# Altium schematic sheet DS157-1.0-A心率传感器.SchDoc
size A4; SheetNumber: 1; SheetTotal: 1
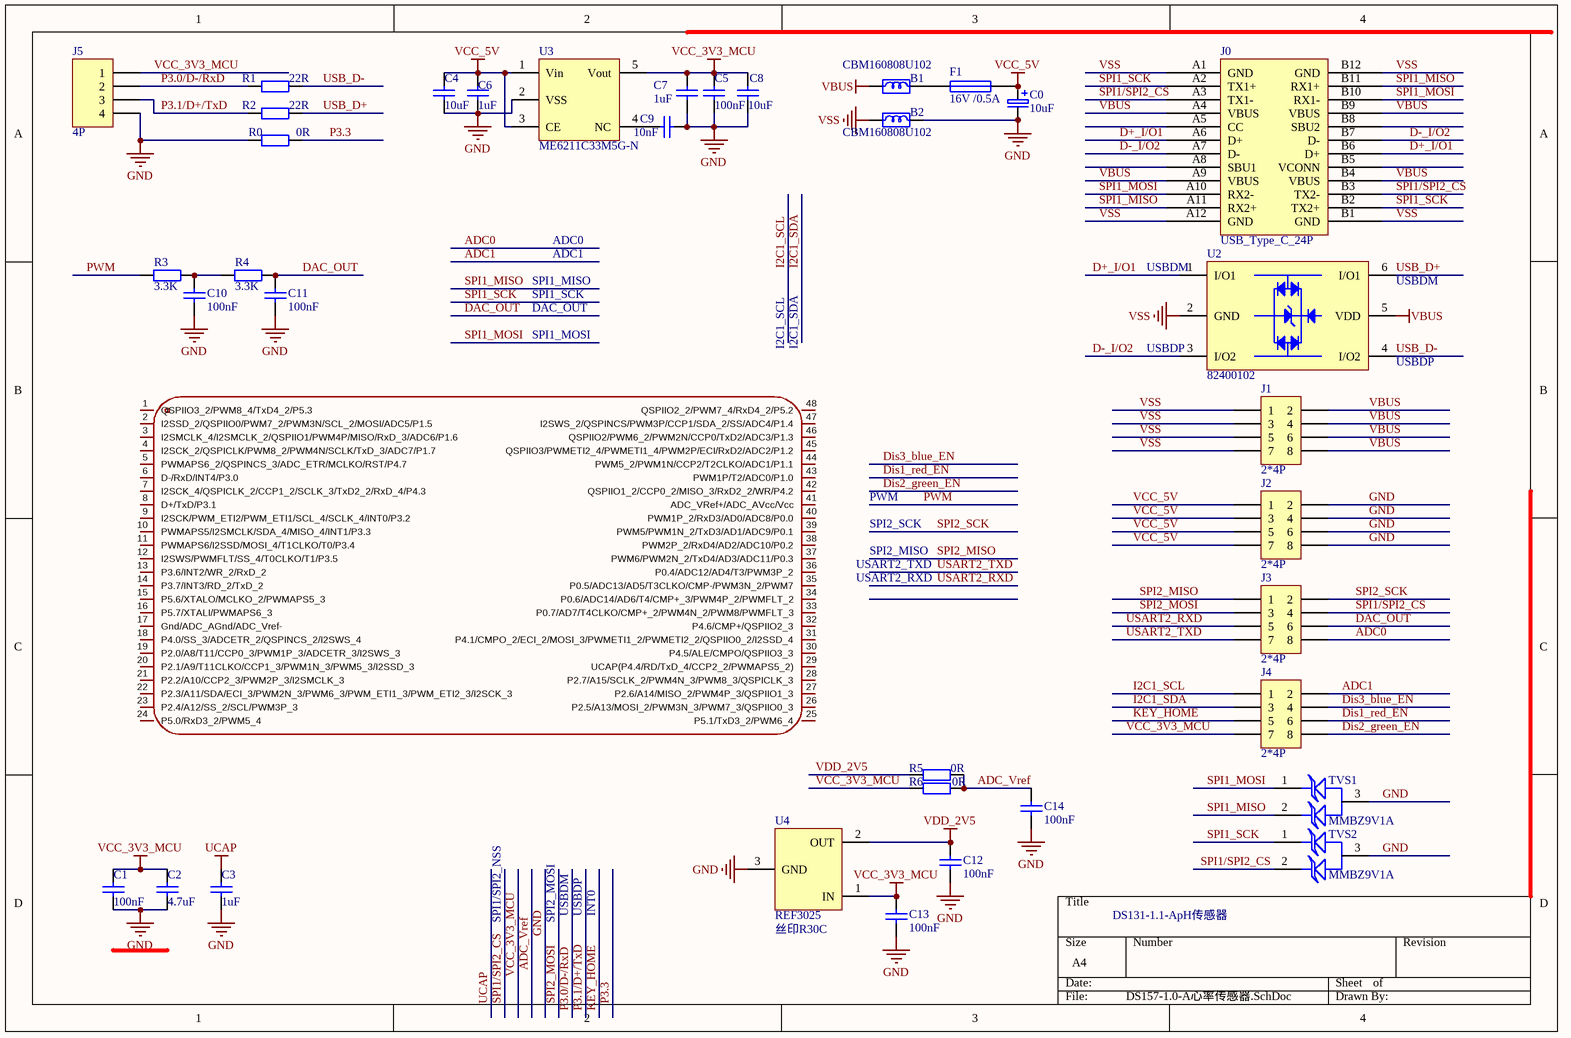
[diagram p0: DS157-1.0-A心率传感器.SchDoc]

## Parts
B1  CBM160808U102  [0603Bead]
B2  CBM160808U102  [0603Bead]
C0  value 10uF  [AVX_3216-18(1206)_SMD]  (hidden comment: AVX_10uF/16V ±10％(C106))
C1  value 100nF  [0603CAP]  (hidden comment: SMDCAP00013)
C2  value 4.7uF  [0603CAP]  (hidden comment: SMDCAP00012)
C3  value 1uF  [0603CAP]  (hidden comment: SMDCAP00015)
C4  value 10uF  [1206CAP]  (hidden comment: MLCC 10uF 50V ±20％ 1206)
C5  value 100nF  [0603CAP]  (hidden comment: SMDCAP00013)
C6  value 1uF  [0603CAP]  (hidden comment: SMDCAP00015)
C7  value 1uF  [0603CAP]  (hidden comment: SMDCAP00015)
C8  value 10uF  [1206CAP]  (hidden comment: MLCC 10uF 50V ±20％ 1206)
C9  value 10nF  [0603CAP]  (hidden comment: SMDCAP00010)
C10  value 100nF  [0603CAP]  (hidden comment: SMDCAP00013)
C11  value 100nF  [0603CAP]  (hidden comment: SMDCAP00013)
C12  value 100nF  [0603CAP]  (hidden comment: SMDCAP00013)
C13  value 100nF  [0603CAP]  (hidden comment: SMDCAP00013)
C14  value 100nF  [0603CAP]  (hidden comment: SMDCAP00013)
F1  value 16V /0.5A  [1206FUSE]  (hidden comment: SMD1206-050C-16V)
J0  USB_Type_C_24P  [USB_TYPE_C_24P_Receptacle]
J1  value 2*4P  [X1321FVS-2x04-C43D48]  (hidden comment: X1321FVS-2x04-C43D48)
J2  value 2*4P  [X1321FVS-2x04-C43D48]  (hidden comment: X1321FVS-2x04-C43D48)
J3  value 2*4P  [X1321FVS-2x04-C43D48]  (hidden comment: X1321FVS-2x04-C43D48)
J4  value 2*4P  [X1321FVS-2x04-C43D48]  (hidden comment: X1321FVS-2x04-C43D48)
J5  value 4P  [H4]  (hidden comment: DIP4单排直针  间距2mm 针长11mm 铜)
R0  value 0R  [0603RES]  (hidden comment: Chip 0R 1/16W ±1％ 0603)
R1  value 22R  [0603RES]  (hidden comment: Chip 22R 1/16W ±1％ 0603)
R2  value 22R  [0603RES]  (hidden comment: Chip 22R 1/16W ±1％ 0603)
R3  value 3.3K  [0603RES]  (hidden comment: SMDRES00090)
R4  value 3.3K  [0603RES]  (hidden comment: SMDRES00090)
R5  value 0R  [0603RES]  (hidden comment: Chip 0R 1/16W ±1％ 0603)
R6  value 0R  [0603RES]  (hidden comment: Chip 0R 1/16W ±1％ 0603)
TVS1  MMBZ9V1A  [SOT23]
TVS2  MMBZ9V1A  [SOT23]
U2  82400102  [SOT23-6]
U3  ME6211C33M5G-N  [SOT23-5]
U4  REF3025  value 丝印R30C  [SOT23]
U?  stc8051u-34k64-qfp48  [LQFP-48]  (value not drawn)

## Nets
GND: B2.2 C0.2 C1.1 C2.1 C3.1 C4.1 C5.1 C6.1 C7.1 C8.1 C9.2 C10.1 C11.1 C12.1 C13.1 C14.1 J2.2 J2.4 J2.6 J2.8 J5.4 R0.1 TVS1.3 TVS2.3 U3.2(VSS) U4.3(GND)
UCAP: C3.2
VBUS: B1.1 J0.A4(VBUS) J0.A9(VBUS) J0.B4(VBUS) J0.B9(VBUS) J1.2 J1.4 J1.6 J1.8 U2.5(VDD)
VCC_3V3_MCU: C1.2 C2.2 C5.2 C7.2 C8.2 C13.2 J4.7 J5.1 R6.1 U3.5(Vout) U4.1(IN)
VCC_5V: C0.1 C4.2 C6.2 F1.2 J2.1 J2.3 J2.5 J2.7 U3.1(Vin) U3.3(CE)
VDD_2V5: C12.2 R5.1 U4.2(OUT)
VSS: B2.1 J0.A1(GND) J0.A12(GND) J0.B1(GND) J0.B12(GND) J1.1 J1.3 J1.5 J1.7 U2.2(GND)
ADC0: J3.8
ADC1: J4.2
ADC_Vref: C14.2 R5.2 R6.2
D+_I/O1: J0.A6(D+) J0.B6(D+) U2.1(I/O1)
D-_I/O2: J0.A7(D-) J0.B7(D-) U2.3(I/O2)
DAC_OUT: C11.2 J3.6 R4.2
Dis1_red_EN: J4.6
Dis2_green_EN: J4.8
Dis3_blue_EN: J4.4
I2C1_SCL: J4.1
I2C1_SDA: J4.3
KEY_HOME: J4.5
P3.0/D-/RxD: J5.2 R1.1
P3.1/D+/TxD: J5.3 R2.1
P3.3: R0.2
PWM: R3.1
SPI1/SPI2_CS: J0.A3(TX1-) J0.B3(TX2-) J3.4 TVS2.2
SPI1_MISO: J0.A11(RX2+) J0.B11(RX1+) TVS1.2
SPI1_MOSI: J0.A10(RX2-) J0.B10(RX1-) TVS1.1
SPI1_SCK: J0.A2(TX1+) J0.B2(TX2+) TVS2.1
SPI2_MISO: J3.1
SPI2_MOSI: J3.3
SPI2_SCK: J3.2
USART2_RXD: J3.5
USART2_TXD: J3.7
USB_D+: R2.2 U2.6(I/O1)
USB_D-: R1.2 U2.4(I/O2)
NetB1_2: B1.2 F1.1
NetC9_1: C9.1 U3.4(NC)
NetC10_2: C10.2 R3.2 R4.1

Not connected (* = marked no-connect by the designer): J0 A5(CC) A8(SBU1) B5(VCONN) B8(SBU2); U? 1(QSPIIO3_2/PWM8_4/TxD4_2/P5.3) 2(I2SSD_2/QSPIIO0/PWM7_2/PWM3N/SCL_2/MOSI/ADC5/P1.5) 3(I2SMCLK_4/I2SMCLK_2/QSPIIO1/PWM4P/MISO/RxD_3/ADC6/P1.6) 4(I2SCK_2/QSPICLK/PWM8_2/PWM4N/SCLK/TxD_3/ADC7/P1.7) 5(PWMAPS6_2/QSPINCS_3/ADC_ETR/MCLKO/RST/P4.7) 6(D-/RxD/INT4/P3.0) 7(I2SCK_4/QSPICLK_2/CCP1_2/SCLK_3/TxD2_2/RxD_4/P4.3) 8(D+/TxD/P3.1) 9(I2SCK/PWM_ETI2/PWM_ETI1/SCL_4/SCLK_4/INT0/P3.2) 10(PWMAPS5/I2SMCLK/SDA_4/MISO_4/INT1/P3.3) 11(PWMAPS6/I2SSD/MOSI_4/T1CLKO/T0/P3.4) 12(I2SWS/PWMFLT/SS_4/T0CLKO/T1/P3.5) 13(P3.6/INT2/WR_2/RxD_2) 14(P3.7/INT3/RD_2/TxD_2) 15(P5.6/XTALO/MCLKO_2/PWMAPS5_3) 16(P5.7/XTALI/PWMAPS6_3) 17(Gnd/ADC_AGnd/ADC_Vref-) 18(P4.0/SS_3/ADCETR_2/QSPINCS_2/I2SWS_4) 19(P2.0/A8/T11/CCP0_3/PWM1P_3/ADCETR_3/I2SWS_3) 20(P2.1/A9/T11CLKO/CCP1_3/PWM1N_3/PWM5_3/I2SSD_3) 21(P2.2/A10/CCP2_3/PWM2P_3/I2SMCLK_3) 22(P2.3/A11/SDA/ECI_3/PWM2N_3/PWM6_3/PWM_ETI1_3/PWM_ETI2_3/I2SCK_3) 23(P2.4/A12/SS_2/SCL/PWM3P_3) 24(P5.0/RxD3_2/PWM5_4) 25(P5.1/TxD3_2/PWM6_4) 26(P2.5/A13/MOSI_2/PWM3N_3/PWM7_3/QSPIIO0_3) 27(P2.6/A14/MISO_2/PWM4P_3/QSPIIO1_3) 28(P2.7/A15/SCLK_2/PWM4N_3/PWM8_3/QSPICLK_3) 29(UCAP(P4.4/RD/TxD_4/CCP2_2/PWMAPS5_2)) 30(P4.5/ALE/CMPO/QSPIIO3_3) 31(P4.1/CMPO_2/ECI_2/MOSI_3/PWMETI1_2/PWMETI2_2/QSPIIO0_2/I2SSD_4) 32(P4.6/CMP+/QSPIIO2_3) 33(P0.7/AD7/T4CLKO/CMP+_2/PWM4N_2/PWM8/PWMFLT_3) 34(P0.6/ADC14/AD6/T4/CMP+_3/PWM4P_2/PWMFLT_2) 35(P0.5/ADC13/AD5/T3CLKO/CMP-/PWM3N_2/PWM7) 36(P0.4/ADC12/AD4/T3/PWM3P_2) 37(PWM6/PWM2N_2/TxD4/AD3/ADC11/P0.3) 38(PWM2P_2/RxD4/AD2/ADC10/P0.2) 39(PWM5/PWM1N_2/TxD3/AD1/ADC9/P0.1) 40(PWM1P_2/RxD3/AD0/ADC8/P0.0) 41(ADC_VRef+/ADC_AVcc/Vcc) 42(QSPIIO1_2/CCP0_2/MISO_3/RxD2_2/WR/P4.2) 43(PWM1P/T2/ADC0/P1.0) 44(PWM5_2/PWM1N/CCP2/T2CLKO/ADC1/P1.1) 45(QSPIIO3/PWMETI2_4/PWMETI1_4/PWM2P/ECI/RxD2/ADC2/P1.2) 46(QSPIIO2/PWM6_2/PWM2N/CCP0/TxD2/ADC3/P1.3) 47(I2SWS_2/QSPINCS/PWM3P/CCP1/SDA_2/SS/ADC4/P1.4) 48(QSPIIO2_2/PWM7_4/RxD4_2/P5.2)

## Notes on the sheet
- ADC0
- SPI1_MISO
- SPI1_SCK
- DAC_OUT
- ADC1
- (near U2) USBDM
- SPI1_MOSI
- I2C1_SCL
- I2C1_SDA
- (near U2) USBDP
- PWM
- USART2_TXD
- USART2_RXD
- SPI2_SCK
- SPI2_MISO
- SPI1/SPI2_NSS
- SPI2_MOSI
- USBDM
- USBDP
- INT0
- DS131-1.1-ApH传感器

## Library data of the parts
B1 B2 = Chip Ferrite Bead 0606: 贴片磁珠
C0 = AVX_10uF/16V ±10％(C106): 钽电容
C1 C5 C10-C14 = MLCC 100nF 50V ±10％ 0603: 贴片电容
C2 = MLCC 4.7uF 50V ±10％ 0603: 贴片电容
C3 C6 C7 = MLCC 1uF 50V ±10％ 0603: 贴片电容
C4 C8 = MLCC 10uF 50V ±20％ 1206: 贴片电容
C9 = MLCC 10nF 50V ±10％ 0603: 贴片电容
F1 = SMD1206-050C-16V: 贴片自恢复保险丝 16V /0.5A
J1-J4 = X1321FVS-2x04-C43D48: 双排母2x4P 立贴 1.27mm
J5 = DIP4单排直针  间距2mm 针长11mm 铜: 单排直针
R0 R5 R6 = Chip 0R 1/16W ±1％ 0603: 贴片电阻
R1 R2 = Chip 22R 1/16W ±1％ 0603: 贴片电阻
R3 R4 = Chip 3.3K 1/16W ±1％ 0603: 贴片电阻
TVS1 TVS2 = TVS: 瞬态抑制二极管
U2 = 82400102: 瞬态抑制二极管(TVS)
U3 = ME6211C33M5G-N: 稳压芯片
U? = STC8051u-34k64-LQFP48: 硬件浮点/硬件三角函数 跑100MHz, 32位8051-CPU 跑 42MHz，PWM 有硬件移相功能，DMA支持外设到外设，DMA支持PWM; Manufacturer: STC; AddInBom: yes; ModelId: 093be70396ff421eb2cdb946d5311efc; ModelName: LQFP-48_L7.0-W7.0-H1.4-LS9.0-P0.50; ModelTransform: 354.331,354.331,0,0,0,0,0,0,0; Symbol: STC8051U-34K64-QFP48; LCSC Part Name: 32位8051单片机，超强抗干扰，超级加密，高稳定，低功耗; SupplierPart: C24833775; ManufacturerPart: STC8051U-34K64-QFP48; Supplier Footprint: LQFP-48(7x7); JLCPCB Part Class: Extended Part; Datasheet: https://item.szlcsc.com/datasheet/STC8051U-34K64-QFP48/26562160.html; Supplier: LCSC; ConvertToPcb: yes; FootprintName: LQFP-48_L7.0-W7.0-P0.50-LS9.0-BL